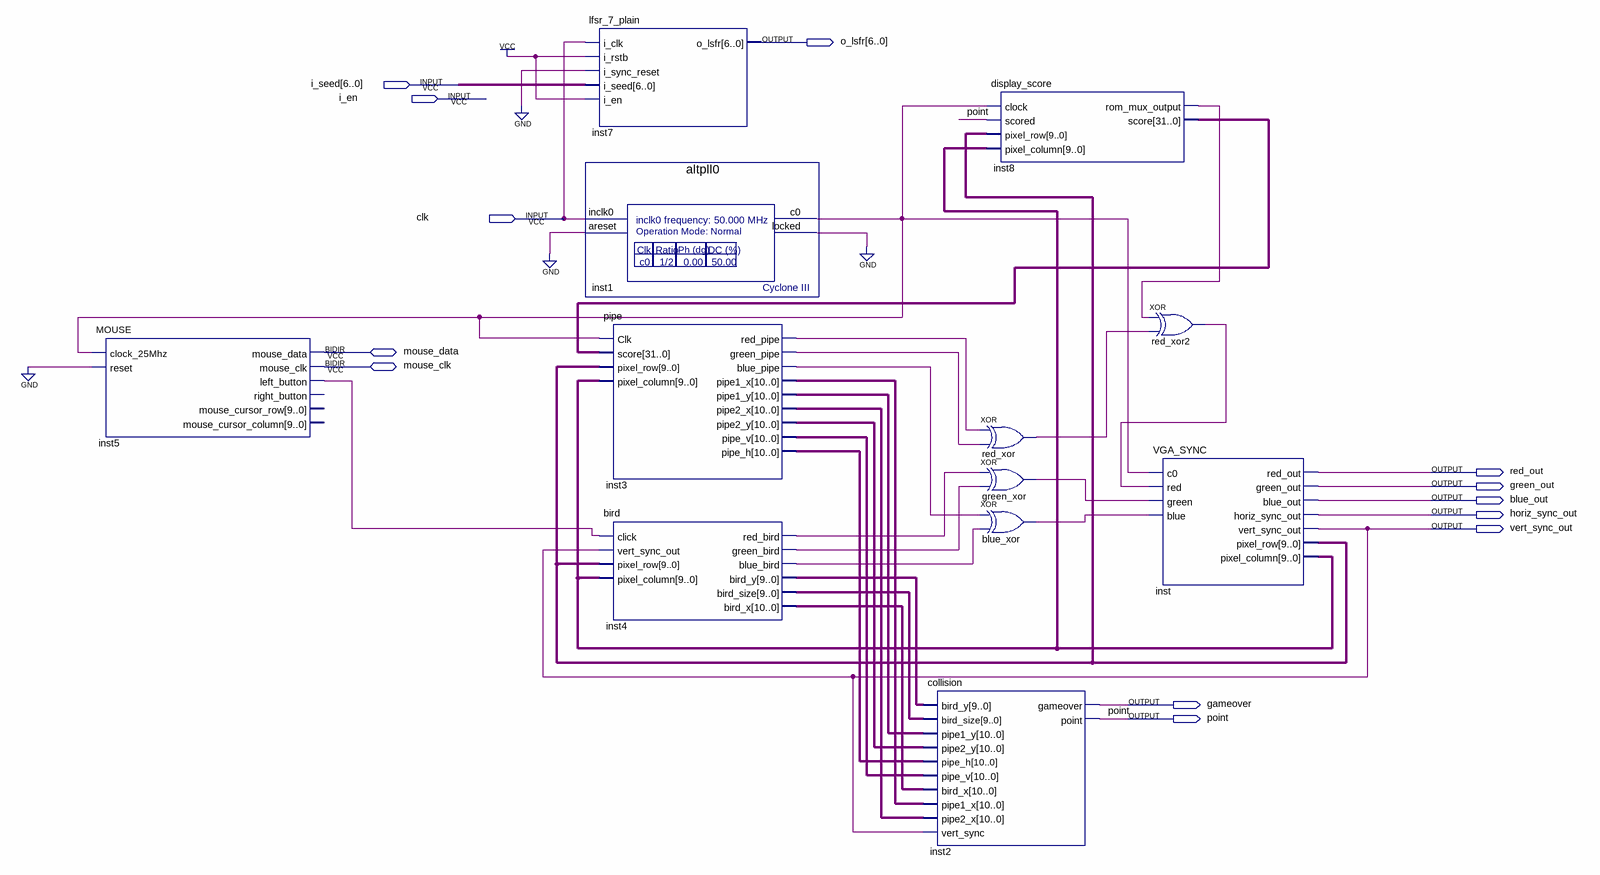
[diagram p0: schematic sheet]
// Quartus schematic move_pipe.bdf as structural Verilog: 12 symbols, 13 pins
module move_pipe (
  input  [6:0] i_seed,
  input  i_en,
  input  clk,
  inout  mouse_data,
  inout  mouse_clk,
  output [6:0] o_lsfr,
  output red_out,
  output green_out,
  output blue_out,
  output horiz_sync_out,
  output vert_sync_out,
  output gameover,
  output point
);

  wire blue_xor_out, green_xor_out, inst1_c0, inst1_locked, inst3_blue_pipe, inst3_green_pipe,
       inst3_red_pipe, inst4_blue_bird, inst4_green_bird, inst4_red_bird, inst5_left_button,
       inst8_rom_mux_output, red_xor2_out, red_xor_out;
  wire [9:0] inst4_bird_size, inst4_bird_y, inst_pixel_column, inst_pixel_row;
  wire [10:0] inst3_pipe1_x, inst3_pipe1_y, inst3_pipe2_x, inst3_pipe2_y, inst3_pipe_h, inst3_pipe_v,
       inst4_bird_x;
  wire [31:0] inst8_score;

  MOUSE inst5 (
    .clock_25Mhz(inst1_c0), .reset(1'b0), .left_button(inst5_left_button), .mouse_data(mouse_data),
    .mouse_clk(mouse_clk));  // open: right_button, mouse_cursor_row, mouse_cursor_column
  lfsr_7_plain inst7 (.i_clk(clk), .i_rstb(1'b1), .i_sync_reset(1'b0), .i_seed(i_seed), .i_en(1'b1), .o_lsfr(o_lsfr));
  altpll0 inst1 (.inclk0(clk), .areset(1'b0), .c0(inst1_c0), .locked(inst1_locked));
  pipe inst3 (
    .Clk(inst1_c0), .score(inst8_score), .pixel_row(inst_pixel_row), .pixel_column(inst_pixel_column),
    .red_pipe(inst3_red_pipe), .green_pipe(inst3_green_pipe), .blue_pipe(inst3_blue_pipe),
    .pipe1_x(inst3_pipe1_x), .pipe1_y(inst3_pipe1_y), .pipe2_x(inst3_pipe2_x), .pipe2_y(inst3_pipe2_y),
    .pipe_v(inst3_pipe_v), .pipe_h(inst3_pipe_h));
  bird inst4 (
    .click(inst5_left_button), .vert_sync_out(vert_sync_out), .pixel_row(inst_pixel_row),
    .pixel_column(inst_pixel_column), .red_bird(inst4_red_bird), .green_bird(inst4_green_bird),
    .blue_bird(inst4_blue_bird), .bird_y(inst4_bird_y), .bird_size(inst4_bird_size), .bird_x(inst4_bird_x));
  collision inst2 (
    .bird_y(inst4_bird_y), .bird_size(inst4_bird_size), .pipe1_y(inst3_pipe1_y), .pipe2_y(inst3_pipe2_y),
    .pipe_h(inst3_pipe_h), .pipe_v(inst3_pipe_v), .bird_x(inst4_bird_x), .pipe1_x(inst3_pipe1_x),
    .pipe2_x(inst3_pipe2_x), .vert_sync(vert_sync_out), .gameover(gameover), .point(point));
  display_score inst8 (
    .clock(inst1_c0), .scored(point), .pixel_row(inst_pixel_row), .pixel_column(inst_pixel_column),
    .rom_mux_output(inst8_rom_mux_output), .score(inst8_score));
  xor red_xor (red_xor_out, inst3_red_pipe, inst3_green_pipe);
  xor green_xor (green_xor_out, inst4_red_bird, inst4_green_bird);
  xor blue_xor (blue_xor_out, inst3_blue_pipe, inst4_blue_bird);
  xor red_xor2 (red_xor2_out, inst8_rom_mux_output, red_xor_out);
  VGA_SYNC inst (
    .c0(inst1_c0), .red(red_xor2_out), .green(green_xor_out), .blue(blue_xor_out), .red_out(red_out),
    .green_out(green_out), .blue_out(blue_out), .horiz_sync_out(horiz_sync_out),
    .vert_sync_out(vert_sync_out), .pixel_row(inst_pixel_row), .pixel_column(inst_pixel_column));
  // also tied to GND on the sheet: inst1_locked
endmodule
